# Altium schematic sheet extender.SchDoc
size A4
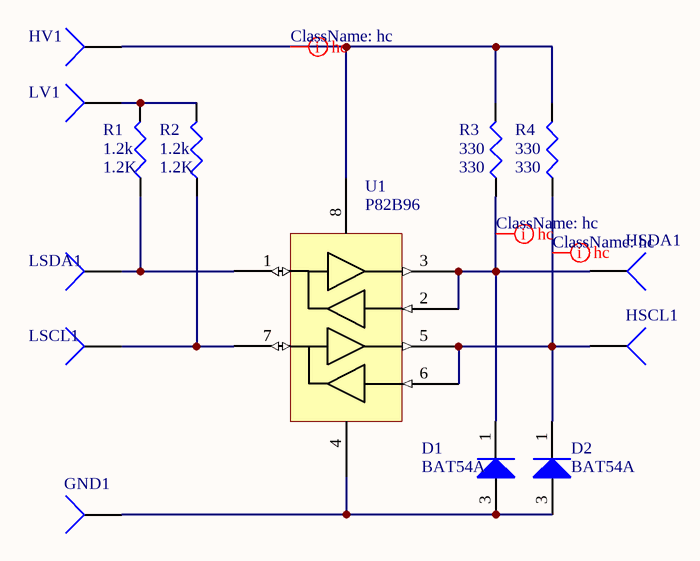
[diagram p0: extender.SchDoc]

## Parts
D1  BAT54A  [SOT-23_N]
D2  BAT54A  [SOT-23_N]
GND1  GND  [PIN1]  (value not drawn)
HSCL1  SCL  [PIN1]  (value not drawn)
HSDA1  SDA  [PIN1]  (value not drawn)
HV1  5V  [PIN1]  (value not drawn)
LSCL1  SCL  [PIN1]  (value not drawn)
LSDA1  SDA  [PIN1]  (value not drawn)
LV1  5V  [PIN1]  (value not drawn)
R1  1.2k  [J1-0603]
R2  1.2k  [J1-0603]
R3  330  [R1206]
R4  330  [R1206]
U1  P82B96  [8VSSOP]

## Nets
NetD1_1: D1.1(K) HSDA1.1 R3.1 U1.2 U1.3
NetD1_3: D1.3(A) D2.3(A) GND1.1 U1.4
NetD2_1: D2.1(K) HSCL1.1 R4.1 U1.5 U1.6
NetHV1_1: HV1.1 R3.2 R4.2 U1.8
NetLSCL1_1: LSCL1.1 R2.1 U1.7
NetLSDA1_1: LSDA1.1 R1.1 U1.1
NetLV1_1: LV1.1 R1.2 R2.2

## Layout directives
net class hc: NetD1_1, NetD2_1, NetHV1_1

## Library data of the parts
D1 D2 = Diode: Default Diode; Published: 8-Jun-2000; LatestRevisionDate: 17-Jul-2002; LatestRevisionNote: Re-released for DXP Platform.; PackageVersion: Sep-1996; PackageReference: SMC; Publisher: Altium Limited; PackageDescription: DO-214-AB/SMC; 2 C-Bend Leads; Body 7.9 x 5.9 mm, inc. leads (LxW); Code_JEDEC: DO-214-AB
GND1 HSCL1 HSDA1 HV1 LSCL1 LSDA1 LV1 = Socket: LatestRevisionDate: 17-Jul-2002; LatestRevisionNote: Re-released for DXP Platform.; Publisher: Altium Limited
R1-R4 = Res3: Resistor; Published: 8-Jun-2000; LatestRevisionDate: 29-May-2009; LatestRevisionNote: IPC-7351 Footprint Added.; PackageReference: J1-0603; Publisher: Altium Limited; PackageDescription: Chip Resistor
  R1 R2: Value: 1.2K
  R3 R4: Value: 330